# EAGLE schematic Sunrise (EAGLE 7.6.0)
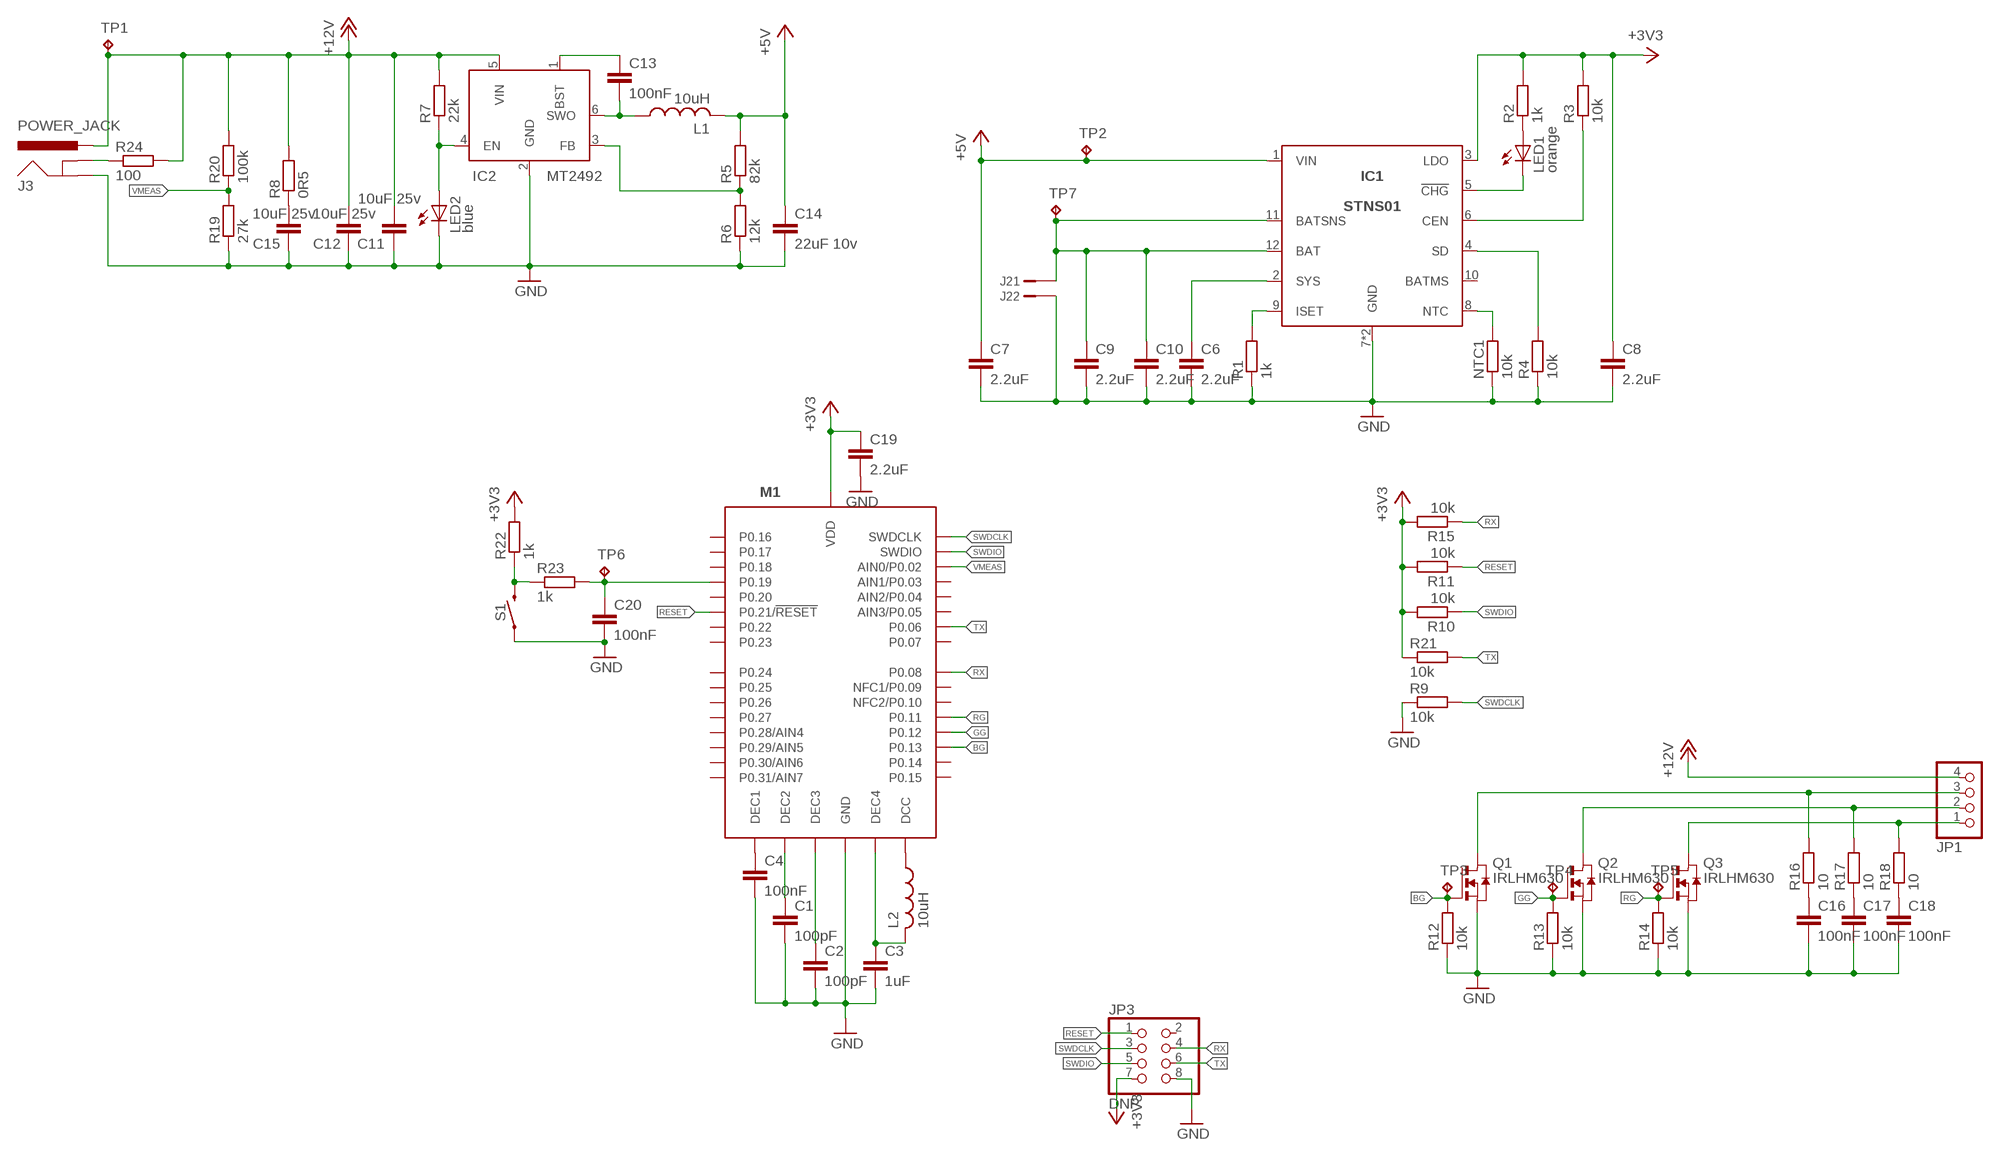
[diagram p0: schematic, sheet 1]

## Parts
C1  100pF  C-EUC0402K  [C0402K]
C2  100pF  C-EUC0402K  [C0402K]
C3  1uF  C-EUC0603K  [C0603K]
C4  100nF  C-EUC0402K  [C0402K]
C6  2.2uF  C-EUC0603K  [C0603K]
C7  2.2uF  C-EUC0603K  [C0603K]
C8  2.2uF  C-EUC0603K  [C0603K]
C9  2.2uF  C-EUC0603K  [C0603K]
C10  2.2uF  C-EUC0603K  [C0603K]
C11  10uF 25v  C-EUC1206K  [C1206K]
C12  10uF 25v  C-EUC1206K  [C1206K]
C13  100nF  C-EUC0402K  [C0402K]
C14  22uF 10v  C-EUC1206K  [C1206K]
C15  10uF 25v  C-EUC1206K  [C1206K]
C16  100nF  C-EUC0402K  [C0402K]
C17  100nF  C-EUC0402K  [C0402K]
C18  100nF  C-EUC0402K  [C0402K]
C19  2.2uF  C-EUC0603K  [C0603K]
C20  100nF  C-EUC0402K  [C0402K]
IC1  STNS01  [DFN12L-3MM]
IC2  MT2492  [SOT23-6]
J2  B2B-PH-K-S  [B2B-PH-K-S]
J3  POWER_JACK  [POWER_JACK_PTH]
JP1  PINHD-1X4/90  [1X04/90]
JP3  DNP  PINHD-2X4  [2X04]
L1  10uH  INDUCTOR5050  [2020-5050]
L2  10uH  INDUCTOR1608  [0603-1608]
LED1  orange  LEDCHIP-LED0603  [CHIP-LED0603]
LED2  blue  LEDCHIP-LED0603  [CHIP-LED0603]
M1  E73-2G4M04S  [E73-2GM404S]
NTC1  10k  R-EU_R0402  [R0402]
Q1  IRLHM630  NMOS-MLP8-33  [MLP8-33]
Q2  IRLHM630  NMOS-MLP8-33  [MLP8-33]
Q3  IRLHM630  NMOS-MLP8-33  [MLP8-33]
R1  1k  R-EU_R0402  [R0402]
R2  1k  R-EU_R0402  [R0402]
R3  10k  R-EU_R0402  [R0402]
R4  10k  R-EU_R0402  [R0402]
R5  82k  R-EU_R0402  [R0402]
R6  12k  R-EU_R0402  [R0402]
R7  22k  R-EU_R0402  [R0402]
R8  0R5  R-EU_R0402  [R0402]
R9  10k  R-EU_R0402  [R0402]
R10  10k  R-EU_R0402  [R0402]
R11  10k  R-EU_R0402  [R0402]
R12  10k  R-EU_R0402  [R0402]
R13  10k  R-EU_R0402  [R0402]
R14  10k  R-EU_R0402  [R0402]
R15  10k  R-EU_R0402  [R0402]
R16  10  R-EU_R0402  [R0402]
R17  10  R-EU_R0402  [R0402]
R18  10  R-EU_R0402  [R0402]
R19  27k  R-EU_R0402  [R0402]
R20  100k  R-EU_R0402  [R0402]
R21  10k  R-EU_R0402  [R0402]
R22  1k  R-EU_R0402  [R0402]
R23  1k  R-EU_R0402  [R0402]
R24  100  R-EU_R0402  [R0402]
S1  MOMENTARY-SWITCH-SPST-SMD-5.2MM  [TACTILE_SWITCH_SMD_5.2MM]
TP1  TPTP10R  [TP10R]
TP2  TPTP10R  [TP10R]
TP3  TPTP10R  [TP10R]
TP4  TPTP10R  [TP10R]
TP5  TPTP10R  [TP10R]
TP6  TPTP10R  [TP10R]
TP7  TPTP10R  [TP10R]

## Nets
+3V3: C8.1 C19.1 IC1.3(LDO) JP3.7 M1.16(VDD) R2.2 R3.2 R10.2 R11.2 R15.2 R21.1 R22.2
+5V: C7.1 C14.1 IC1.1(VIN) L1.2 R5.2 TP2.TP
+12V: C11.1 C12.1 IC2.5(VIN) J3.PWR JP1.4 R7.2 R8.2 R20.2 R24.2 TP1.TP
BG: M1.28(P0.13) Q1.GATE(G) R12.2 TP3.TP
GG: M1.27(P0.12) Q2.GATE(G) R13.2 TP4.TP
GND: C1.2 C2.2 C3.2 C4.2 C6.2 C7.2 C8.2 C9.2 C10.2 C11.2 C12.2 C14.2 C15.2 C16.2 C17.2 C18.2 C19.2 C20.2 IC1.7(GND) IC1.PAD(GND) IC2.2(GND) J2.2 J3.GND JP3.8 LED2.C M1.0(GND) M1.1(GND) M1.2(GND) M1.15(GND) M1.42(GND) M1.43(GND) NTC1.1 Q1.S1(S) Q1.S2(S) Q1.S3(S) Q2.S1(S) Q2.S2(S) Q2.S3(S) Q3.S1(S) Q3.S2(S) Q3.S3(S) R1.1 R4.1 R6.1 R9.1 R12.1 R13.1 R14.1 R19.1 S1.1
N$1: C4.1 M1.14(DEC1)
N$2: C1.1 M1.3(DEC2)
N$3: C3.1 L2.2 M1.12(DEC4)
N$4: C2.1 M1.4(DEC3)
N$5: L2.1 M1.13(DCC)
N$6: C9.1 C10.1 IC1.11(BATSNS) IC1.12(BAT) J2.1 TP7.TP
N$7: C6.1 IC1.2(SYS)
N$8: IC1.8(NTC) NTC1.2
N$9: IC1.9(ISET) R1.2
N$10: LED1.A R2.1
N$11: IC1.5(!CHG) LED1.C
N$12: IC1.6(CEN) R3.1
N$13: IC1.4(SD) R4.2
N$14: C15.1 R8.1
N$15: JP1.1 Q3.D1(D) Q3.D2(D) Q3.D3(D) Q3.D4(D) Q3.DRAIN0(D) R18.2
N$16: JP1.2 Q2.D1(D) Q2.D2(D) Q2.D3(D) Q2.D4(D) Q2.DRAIN0(D) R17.2
N$17: C13.1 IC2.1(BST)
N$18: IC2.3(FB) R5.1 R6.2
N$19: JP1.3 Q1.D1(D) Q1.D2(D) Q1.D3(D) Q1.D4(D) Q1.DRAIN0(D) R16.2
N$20: C13.2 IC2.6(SWO) L1.1
N$21: IC2.4(EN) LED2.A R7.1
N$22: C16.1 R16.1
N$23: C17.1 R17.1
N$24: C18.1 R18.1
N$25: R22.1 R23.1 S1.3
N$26: C20.1 M1.34(P0.19) R23.2 TP6.TP
N$27: J3.GNDBREAK R24.1
RESET: JP3.1 M1.36(P0.21/!RESET) R11.1
RG: M1.26(P0.11) Q3.GATE(G) R14.2 TP5.TP
RX: JP3.4 M1.23(P0.08) R15.1
SWDCLK: JP3.3 M1.37(SWDCLK) R9.2
SWDIO: JP3.5 M1.38(SWDIO) R10.1
TX: JP3.6 M1.21(P0.06) R21.2
VMEAS: M1.17(AIN0/P0.02) R19.2 R20.1
Unconnected: IC1.10(BATMS) JP3.2 M1.5(P0.25) M1.6(P0.26) M1.7(P0.27) M1.8(P0.28/AIN4) M1.9(P0.29/AIN5) M1.10(P0.30/AIN6) M1.11(P0.31/AIN7) M1.18(AIN1/P0.03) M1.19(AIN2/P0.04) M1.20(AIN3/P0.05) M1.22(P0.07) M1.24(NFC1/P0.09) M1.25(NFC2/P0.10) M1.29(P0.14) M1.30(P0.15) M1.31(P0.16) M1.32(P0.17) M1.33(P0.18) M1.35(P0.20) M1.39(P0.22) M1.40(P0.23) M1.41(P0.24)

## Library data of the parts
C1-C4 C6-C20 = rcl:C-EU: CAPACITOR, European symbol
IC1 = STNS01:STNS01
IC2 = MT2492:MT2492
J2 = con-JST-PH:B2B-PH-K-S: JST-PH 2-way vertical TH
J3 = SparkFun-Connectors:POWER_JACK: Power Jack Connector This is the standard 5.5mm barrel jack for power. The PTH is the most common, proven, reliable, footprint. The Slot footprint only works if the mill layer is transmitted to the PCB fab house so be warned. Here are the connectors we sell at SparkFun: DC Barrel Power Jack/Connector <https://www.sparkfun.com/products/119> (PRT-00119) DC Barrel Power Jack/Connector (SMD) <https://www.sparkfun.com/products/12748> (PRT-12748) DC Barrel Jack Adapter - Breadboard Compatible <https://www.sparkfun.com/products/10811> (PRT-10811) It is used on this SparkFun product (and many, many others): SparkFun RedBoard - Programmed with Arduino <https://www.sparkfun.com/products/12757> (DEV-12757) Also, if you need a mating power supply or connector, please check these out: Wall Adapter Power Supply - 9VDC 650mA <https://www.sparkfun.com/products/298> (TOL-00298) DC Barrel Jack Adapter - Male <https://www.sparkfun.com/products/10287> (PRT-10287); PROD_ID: CONN-08197
JP1 = pinhead:PINHD-1X4: PIN HEADER
JP3 = pinhead:PINHD-2X4: PIN HEADER
L1 = inductors-murata:INDUCTOR; PN: LQH5BPN100MT0
L2 = inductors-murata:INDUCTOR
LED1 LED2 = led:LED: LED OSRAM: - CHIPLED LG R971, LG N971, LY N971, LG Q971, LY Q971, LO R971, LY R971 LH N974, LH R974 LS Q976, LO Q976, LY Q976 LO Q996 - Hyper CHIPLED LW Q18S LB Q993, LB Q99A, LB R99A - SideLED LS A670, LO A670, LY A670, LG A670, LP A670 LB A673, LV A673, LT A673, LW A673 LH A674 LY A675 LS A676, LA A676, LO A676, LY A676, LW A676 LS A679, LY A679, LG A679 - Hyper Micro SIDELED® LS Y876, LA Y876, LO Y876, LY Y876 LT Y87S - SmartLED LW L88C, LW L88S LB L89C, LB L89S, LG L890 LS L89K, LO L89K, LY L89K LS L896, LA L896, LO L896, LY L896 - TOPLED LS T670, LO T670, LY T670, LG T670, LP T670 LSG T670, LSP T670, LSY T670, LOP T670, LYG T670 LG T671, LOG T671, LSG T671 LB T673, LV T673, LT T673, LW T673 LH T674 LS T676, LA T676, LO T676, LY T676, LB T676, LH T676, LSB T676, LW T676 LB T67C, LV T67C, LT T67C, LS T67K, LO T67K, LY T67K, LW E67C LS E67B, LA E67B, LO E67B, LY E67B, LB E67C, LV E67C, LT E67C LW T67C LS T679, LY T679, LG T679 LS T770, LO T770, LY T770, LG T770, LP T770 LB T773, LV T773, LT T773, LW T773 LH T774 LS E675, LA E675, LY E675, LS T675 LS T776, LA T776, LO T776, LY T776, LB T776 LHGB T686 LT T68C, LB T68C - Hyper Mini TOPLED® LB M676 - Mini TOPLED Santana® LG M470 LS M47K, LO M47K, LY M47K Source: http://www.osram.convergy.de LUXEON: - LUMILED® LXK2-PW12-R00, LXK2-PW12-S00, LXK2-PW14-U00, LXK2-PW14-V00 LXK2-PM12-R00, LXK2-PM12-S00, LXK2-PM14-U00 LXK2-PE12-Q00, LXK2-PE12-R00, LXK2-PE12-S00, LXK2-PE14-T00, LXK2-PE14-U00 LXK2-PB12-K00, LXK2-PB12-L00, LXK2-PB12-M00, LXK2-PB14-N00, LXK2-PB14-P00, LXK2-PB14-Q00 LXK2-PR12-L00, LXK2-PR12-M00, LXK2-PR14-Q00, LXK2-PR14-R00 LXK2-PD12-Q00, LXK2-PD12-R00, LXK2-PD12-S00 LXK2-PH12-R00, LXK2-PH12-S00 LXK2-PL12-P00, LXK2-PL12-Q00, LXK2-PL12-R00 Source: www.luxeon.com KINGBRIGHT: KA-3528ASYC Source: www.kingbright.com
M1 = E73-2G4M04S:E73-2G4M04S
NTC1 R1-R24 = rcl:R-EU_: RESISTOR, European symbol
Q1-Q3 = MOSFET:NMOS
S1 = SparkFun-Switches:MOMENTARY-SWITCH-SPST: Momentary Switch (Pushbutton) - SPST Normally-open (NO) SPST momentary switches (buttons, pushbuttons). Variants PTH-12MM - 12mm square, through-hole Momentary Pushbutton Switch - 12mm Square <https://www.sparkfun.com/products/9190> (COM-09190) PTH-6.0MM, PTH-6.0MM-KIT - 6.0mm square, through-hole Mini Pushbutton Switch <https://www.sparkfun.com/products/97> (COM-00097) KIT package intended for soldering kit's - only one side of pads' copper is exposed. PTH-RIGHT-ANGLE-KIT - Right-angle, through-hole Right Angle Tactile Button <https://www.sparkfun.com/products/10791> - Used on SparkFun BigTime Watch Kit <https://www.sparkfun.com/products/11734> SMD-12MM - 12mm square, surface-mount Tactile Button - SMD (12mm) <https://www.sparkfun.com/products/12993> (COM-12993) Used on SparkFun PicoBoard <https://www.sparkfun.com/products/11888> SMD-4.5MM - 4.5mm Square Trackball Switch Used on SparkFun Blackberry Trackballer Breakout <https://www.sparkfun.com/products/13169> SMD-4.6MMX2.8MM - 4.60mm x 2.80mm, surface mount Used on SparkFun SAMD21 Mini Breakout <https://www.sparkfun.com/products/13664> SMD-5.2MM, SMD-5.2-REDUNDANT - 5.2mm square, surface-mount Mini Pushbutton Switch - SMD <https://www.sparkfun.com/products/8720> (COM-08720) Used on Arduino Pro Mini <https://www.sparkfun.com/products/11114> REDUNDANT package connects both switch circuits together SMD-6.0X3.5MM - 6.0 x 3.5mm, surface mount Momentary Reset Switch SMD <https://www.sparkfun.com/products/8229> (COM-08229) SMD-6.2MM-TALL - 6.2mm square, surface mount Tactile Button - SMD (6mm) <https://www.sparkfun.com/products/12992> Used on SparkFun Digital Sandbox <https://www.sparkfun.com/products/12651> SMD-RIGHT-ANGLE - Right-angle, surface mount Used on SparkFun Block for Intel® Edison - Arduino <https://www.sparkfun.com/products/13036>; PROD_ID: SWCH-08247; SF_SKU: COM-08720
TP1-TP7 = testpad:TP: Test pad